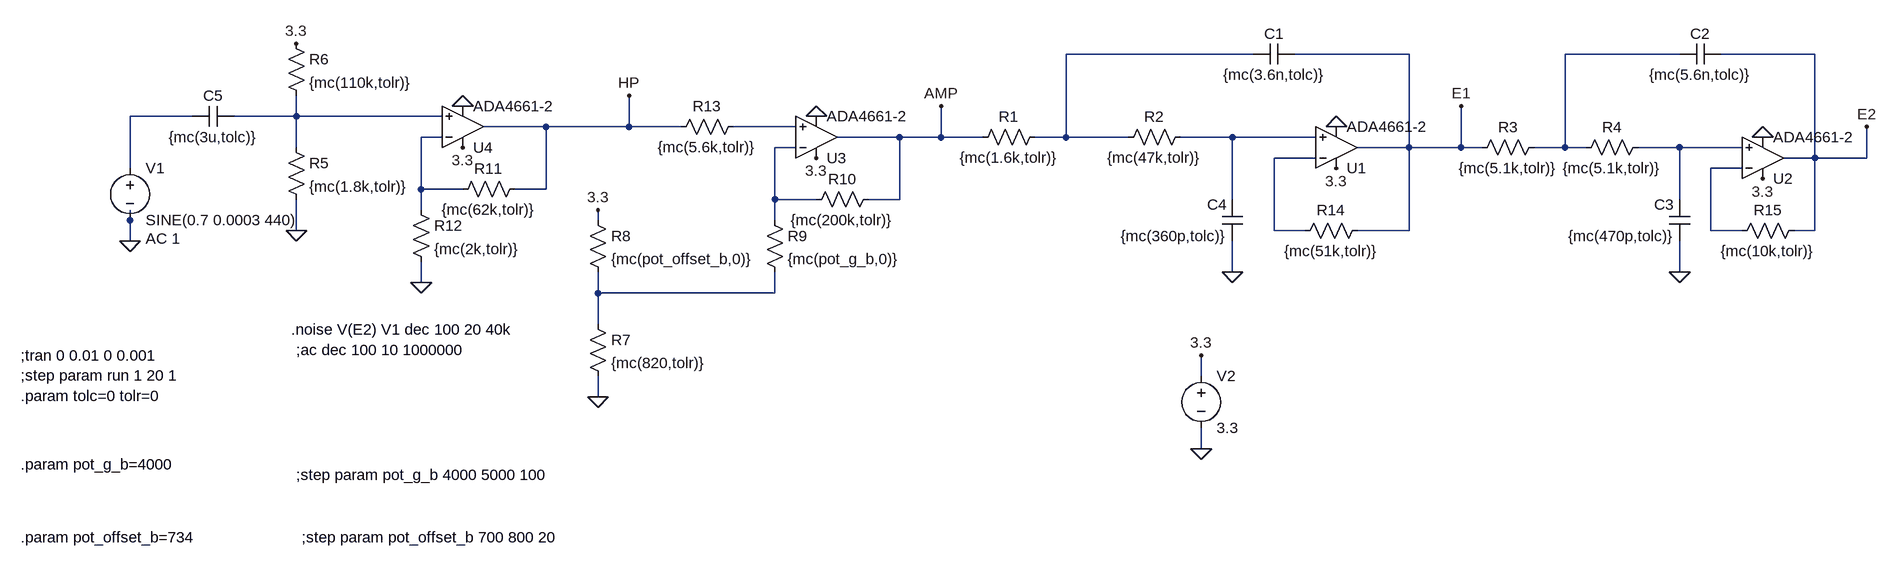
[diagram p0: schematic Simulaciones.asc]
Simulaciones.asc, the LTspice schematic file:
Version 4
SHEET 1 1724 896
WIRE -416 -16 -704 -16
WIRE -176 -16 -352 -16
WIRE 240 -16 64 -16
WIRE 448 -16 304 -16
WIRE -2048 80 -2144 80
WIRE -1888 80 -1888 48
WIRE -1888 80 -1984 80
WIRE -1664 80 -1888 80
WIRE -1504 96 -1600 96
WIRE -1376 96 -1376 48
WIRE -1376 96 -1504 96
WIRE -1296 96 -1376 96
WIRE -1120 96 -1216 96
WIRE -1664 112 -1696 112
WIRE -960 112 -1056 112
WIRE -896 112 -896 64
WIRE -896 112 -960 112
WIRE -832 112 -896 112
WIRE -704 112 -704 -16
WIRE -704 112 -752 112
WIRE -608 112 -704 112
WIRE -448 112 -528 112
WIRE -320 112 -448 112
WIRE -1888 128 -1888 80
WIRE -1120 128 -1152 128
WIRE -176 128 -176 -16
WIRE -176 128 -256 128
WIRE -96 128 -96 64
WIRE -96 128 -176 128
WIRE -64 128 -96 128
WIRE 64 128 64 -16
WIRE 64 128 16 128
WIRE 96 128 64 128
WIRE 240 128 176 128
WIRE 336 128 240 128
WIRE -320 144 -384 144
WIRE 448 144 448 -16
WIRE 448 144 400 144
WIRE 528 144 528 96
WIRE 528 144 448 144
WIRE -2144 160 -2144 80
WIRE 336 160 288 160
WIRE -1696 192 -1696 112
WIRE -1632 192 -1696 192
WIRE -1504 192 -1504 96
WIRE -1504 192 -1552 192
WIRE -1152 208 -1152 128
WIRE -1088 208 -1152 208
WIRE -960 208 -960 112
WIRE -960 208 -1008 208
WIRE -448 208 -448 112
WIRE 240 208 240 128
WIRE -1696 224 -1696 192
WIRE -2144 240 -2144 224
WIRE -1424 240 -1424 224
WIRE -1152 240 -1152 208
WIRE -1888 256 -1888 208
WIRE -384 256 -384 144
WIRE -336 256 -384 256
WIRE -176 256 -176 128
WIRE -176 256 -256 256
WIRE 288 256 288 160
WIRE 336 256 288 256
WIRE 448 256 448 144
WIRE 448 256 416 256
WIRE -2144 272 -2144 240
WIRE -448 320 -448 272
WIRE 240 320 240 272
WIRE -1696 336 -1696 304
WIRE -1424 352 -1424 320
WIRE -1152 352 -1152 320
WIRE -1152 352 -1424 352
WIRE -1424 400 -1424 352
WIRE -496 480 -496 448
WIRE -1424 512 -1424 480
WIRE -496 592 -496 560
FLAG 368 112 0
FLAG -2144 272 0
FLAG -496 592 0
FLAG -496 448 3.3
FLAG 368 176 3.3
FLAG -96 64 E1
FLAG -1888 256 0
FLAG -1632 64 0
FLAG -448 320 0
FLAG 240 320 0
FLAG -1632 128 3.3
FLAG -1888 -32 3.3
FLAG -1696 336 0
FLAG -288 160 3.3
FLAG -288 96 0
FLAG 528 96 E2
FLAG -1088 80 0
FLAG -1088 144 3.3
FLAG -1424 512 0
FLAG -1424 224 3.3
FLAG -1376 48 HP
FLAG -896 64 AMP
SYMBOL Opamps\\ADA4661-2 -288 192 M180
SYMATTR InstName U1
SYMBOL Opamps\\ADA4661-2 368 208 M180
SYMATTR InstName U2
SYMBOL res -736 96 R90
WINDOW 0 0 56 VBottom 2
WINDOW 3 32 56 VTop 2
SYMATTR InstName R1
SYMATTR Value {mc(1.6k,tolr)}
SYMATTR SpiceLine tol=1
SYMBOL res -512 96 R90
WINDOW 0 0 56 VBottom 2
WINDOW 3 32 56 VTop 2
SYMATTR InstName R2
SYMATTR Value {mc(47k,tolr)}
SYMATTR SpiceLine tol=1
SYMBOL res 32 112 R90
WINDOW 0 0 56 VBottom 2
WINDOW 3 32 56 VTop 2
SYMATTR InstName R3
SYMATTR Value {mc(5.1k,tolr)}
SYMATTR SpiceLine tol=1
SYMBOL res 192 112 R90
WINDOW 0 0 56 VBottom 2
WINDOW 3 32 56 VTop 2
SYMATTR InstName R4
SYMATTR Value {mc(5.1k,tolr)}
SYMATTR SpiceLine tol=1
SYMBOL cap -352 -32 R90
WINDOW 0 0 32 VBottom 2
WINDOW 3 32 32 VTop 2
SYMATTR InstName C1
SYMATTR Value {mc(3.6n,tolc)}
SYMBOL cap 304 -32 R90
WINDOW 0 0 32 VBottom 2
WINDOW 3 32 32 VTop 2
SYMATTR InstName C2
SYMATTR Value {mc(5.6n,tolc)}
SYMBOL cap 256 272 R180
WINDOW 0 24 56 Left 2
WINDOW 3 24 8 Left 2
SYMATTR InstName C3
SYMATTR Value {mc(470p,tolc)}
SYMBOL cap -432 272 R180
WINDOW 0 24 56 Left 2
WINDOW 3 24 8 Left 2
SYMATTR InstName C4
SYMATTR Value {mc(360p,tolc)}
SYMBOL voltage -2144 144 R0
WINDOW 123 24 124 Left 2
WINDOW 39 0 0 Left 0
SYMATTR Value2 AC 1
SYMATTR InstName V1
SYMATTR Value SINE(0.7 0.0003 440)
SYMBOL voltage -496 464 R0
WINDOW 123 0 0 Left 0
WINDOW 39 0 0 Left 0
SYMATTR InstName V2
SYMATTR Value 3.3
SYMBOL cap -1984 64 R90
WINDOW 0 0 32 VBottom 2
WINDOW 3 32 32 VTop 2
SYMATTR InstName C5
SYMATTR Value {mc(3u,tolc)}
SYMBOL res -1904 112 R0
SYMATTR InstName R5
SYMATTR Value {mc(1.8k,tolr)}
SYMBOL Opamps\\ADA4661-2 -1632 160 M180
SYMATTR InstName U4
SYMBOL res -1904 -48 R0
SYMATTR InstName R6
SYMATTR Value {mc(110k,tolr)}
SYMBOL res -1648 208 R270
WINDOW 0 32 56 VTop 2
WINDOW 3 0 56 VBottom 2
SYMATTR InstName R11
SYMATTR Value {mc(62k,tolr)}
SYMBOL res -1712 208 R0
SYMATTR InstName R12
SYMATTR Value {mc(2k,tolr)}
SYMBOL Opamps\\ADA4661-2 -1088 176 M180
SYMATTR InstName U3
SYMBOL res -1168 224 R0
SYMATTR InstName R9
SYMATTR Value {mc(pot_g_b,0)}
SYMBOL res -992 192 R90
WINDOW 0 0 56 VBottom 2
WINDOW 3 32 56 VTop 2
SYMATTR InstName R10
SYMATTR Value {mc(200k,tolr)}
SYMBOL res -1440 384 R0
SYMATTR InstName R7
SYMATTR Value {mc(820,tolr)}
SYMBOL res -1440 224 R0
SYMATTR InstName R8
SYMATTR Value {mc(pot_offset_b,0)}
SYMBOL res -1200 80 R90
WINDOW 0 0 56 VBottom 2
WINDOW 3 32 56 VTop 2
SYMATTR InstName R13
SYMATTR Value {mc(5.6k,tolr)}
SYMBOL res -240 240 R90
WINDOW 0 0 56 VBottom 2
WINDOW 3 32 56 VTop 2
SYMATTR InstName R14
SYMATTR Value {mc(51k,tolr)}
SYMBOL res 432 240 R90
WINDOW 0 0 56 VBottom 2
WINDOW 3 32 56 VTop 2
SYMATTR InstName R15
SYMATTR Value {mc(10k,tolr)}
TEXT -2312 448 Left 2 !;tran 0 0.01 0 0.001\n;step param run 1 20 1\n.param tolc=0 tolr=0
TEXT -1896 408 Left 2 !.noise V(E2) V1 dec 100 20 40k
TEXT -1888 440 Left 2 !;ac dec 100 10 1000000
TEXT -1888 632 Left 2 !;step param pot_g_b 4000 5000 100
TEXT -2312 616 Left 2 !.param pot_g_b=4000
TEXT -2312 728 Left 2 !.param pot_offset_b=734
TEXT -1880 728 Left 2 !;step param pot_offset_b 700 800 20

The netlist it stands for:
* Simulaciones.asc
XU1 N007 N010 3.3 0 E1 ADA4661-2  ; pins In+ In- V+ V- OUT
XU2 N009 N011 3.3 0 E2 ADA4661-2  ; pins In+ In- V+ V- OUT
R1 N001 AMP {mc(1.6k,tolr)} tol=1
R2 N007 N001 {mc(47k,tolr)} tol=1
R3 N002 E1 {mc(5.1k,tolr)} tol=1
R4 N009 N002 {mc(5.1k,tolr)} tol=1
C1 E1 N001 {mc(3.6n,tolc)}
C2 E2 N002 {mc(5.6n,tolc)}
C3 0 N009 {mc(470p,tolc)}
C4 0 N007 {mc(360p,tolc)}
V1 N003 0 SINE(0.7 0.0003 440) AC 1
V2 3.3 0 3.3
C5 N004 N003 {mc(3u,tolc)}
R5 N004 0 {mc(1.8k,tolr)}
XU4 N004 N006 3.3 0 HP ADA4661-2  ; pins In+ In- V+ V- OUT
R6 3.3 N004 {mc(110k,tolr)}
R11 N006 HP {mc(62k,tolr)}
R12 N006 0 {mc(2k,tolr)}
XU3 N005 N008 3.3 0 AMP ADA4661-2  ; pins In+ In- V+ V- OUT
R9 N008 N012 {mc(pot_g_b,0)}
R10 AMP N008 {mc(200k,tolr)}
R7 N012 0 {mc(820,tolr)}
R8 3.3 N012 {mc(pot_offset_b,0)}
R13 N005 HP {mc(5.6k,tolr)}
R14 E1 N010 {mc(51k,tolr)}
R15 E2 N011 {mc(10k,tolr)}
;tran 0 0.01 0 0.001
;step param run 1 20 1
.param tolc=0 tolr=0
.noise V(E2) V1 dec 100 20 40k
;ac dec 100 10 1000000
;step param pot_g_b 4000 5000 100
.param pot_g_b=4000
.param pot_offset_b=734
;step param pot_offset_b 700 800 20
.lib ADI1.lib
.backanno
.end